# Altium schematic sheet SX1308_GTW_e381v02c_RF_Part.SchDoc: SX1280_Demo_RF
size A2; DrawnBy: Erik Fountain; DocumentNumber: 2; SheetNumber: 2; SheetTotal: 5; PageSetup: Record=PageOptions|CenterHorizontal=True|CenterVertical=True|PrintScale=0.47|XCorrection=1.00|YCorrection=1.00|PrintKind=0|BorderSize=5000000|LeftOffset=0|BottomOffset=0|Orientation=2|PaperLength=1000|PaperWidth=1000|Scale=100|PaperSource=7|PrintQuality=-4|MediaType=1|DitherType=10|PaperKind=Letter|PrintScaleMode=1; DocumentName: SX1280_Demo_RF
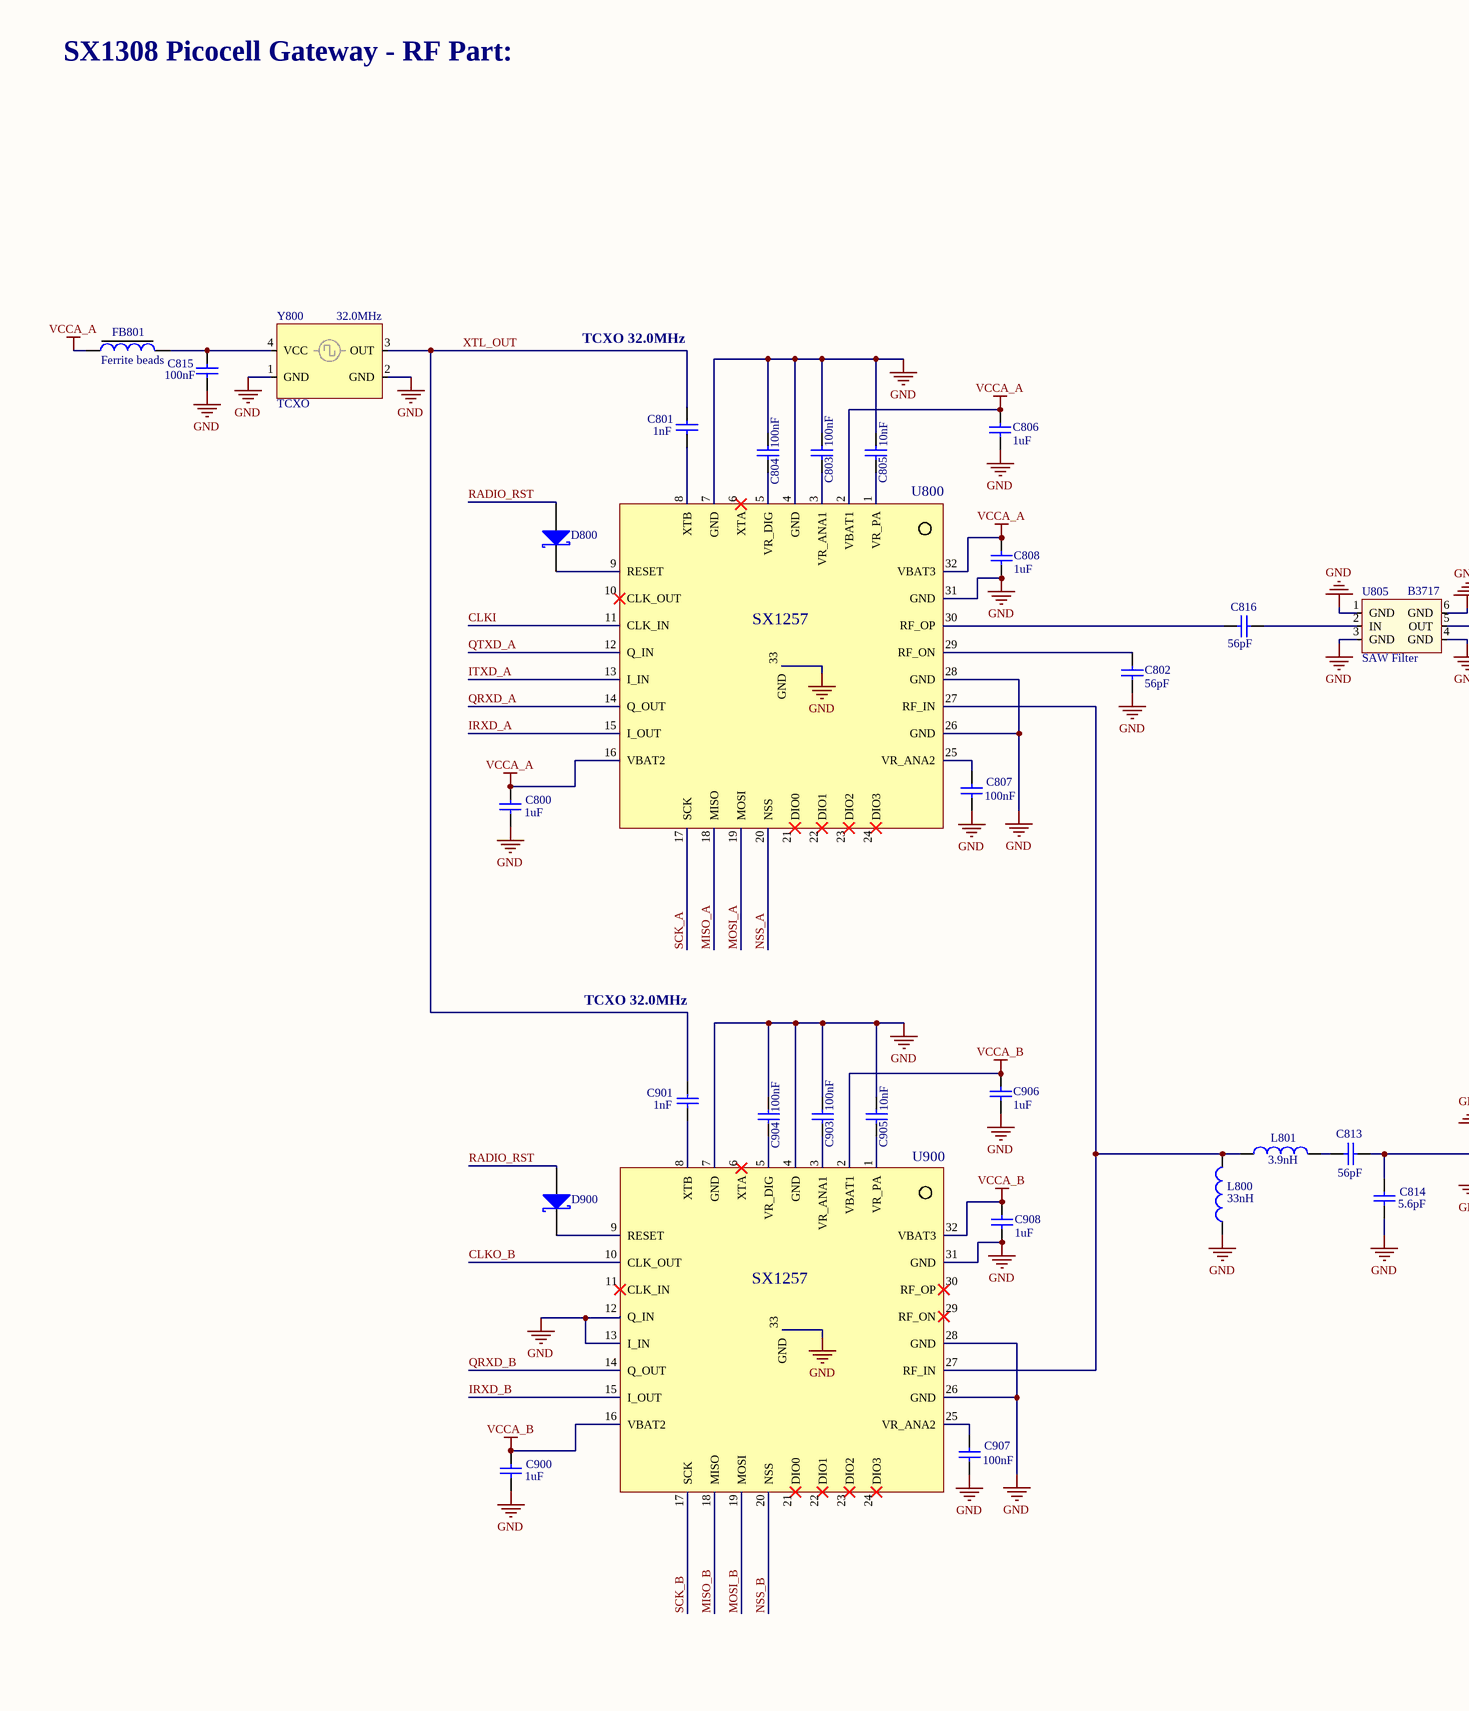
[diagram p0: SX1308_GTW_e381v02c_RF_Part.SchDoc, left]
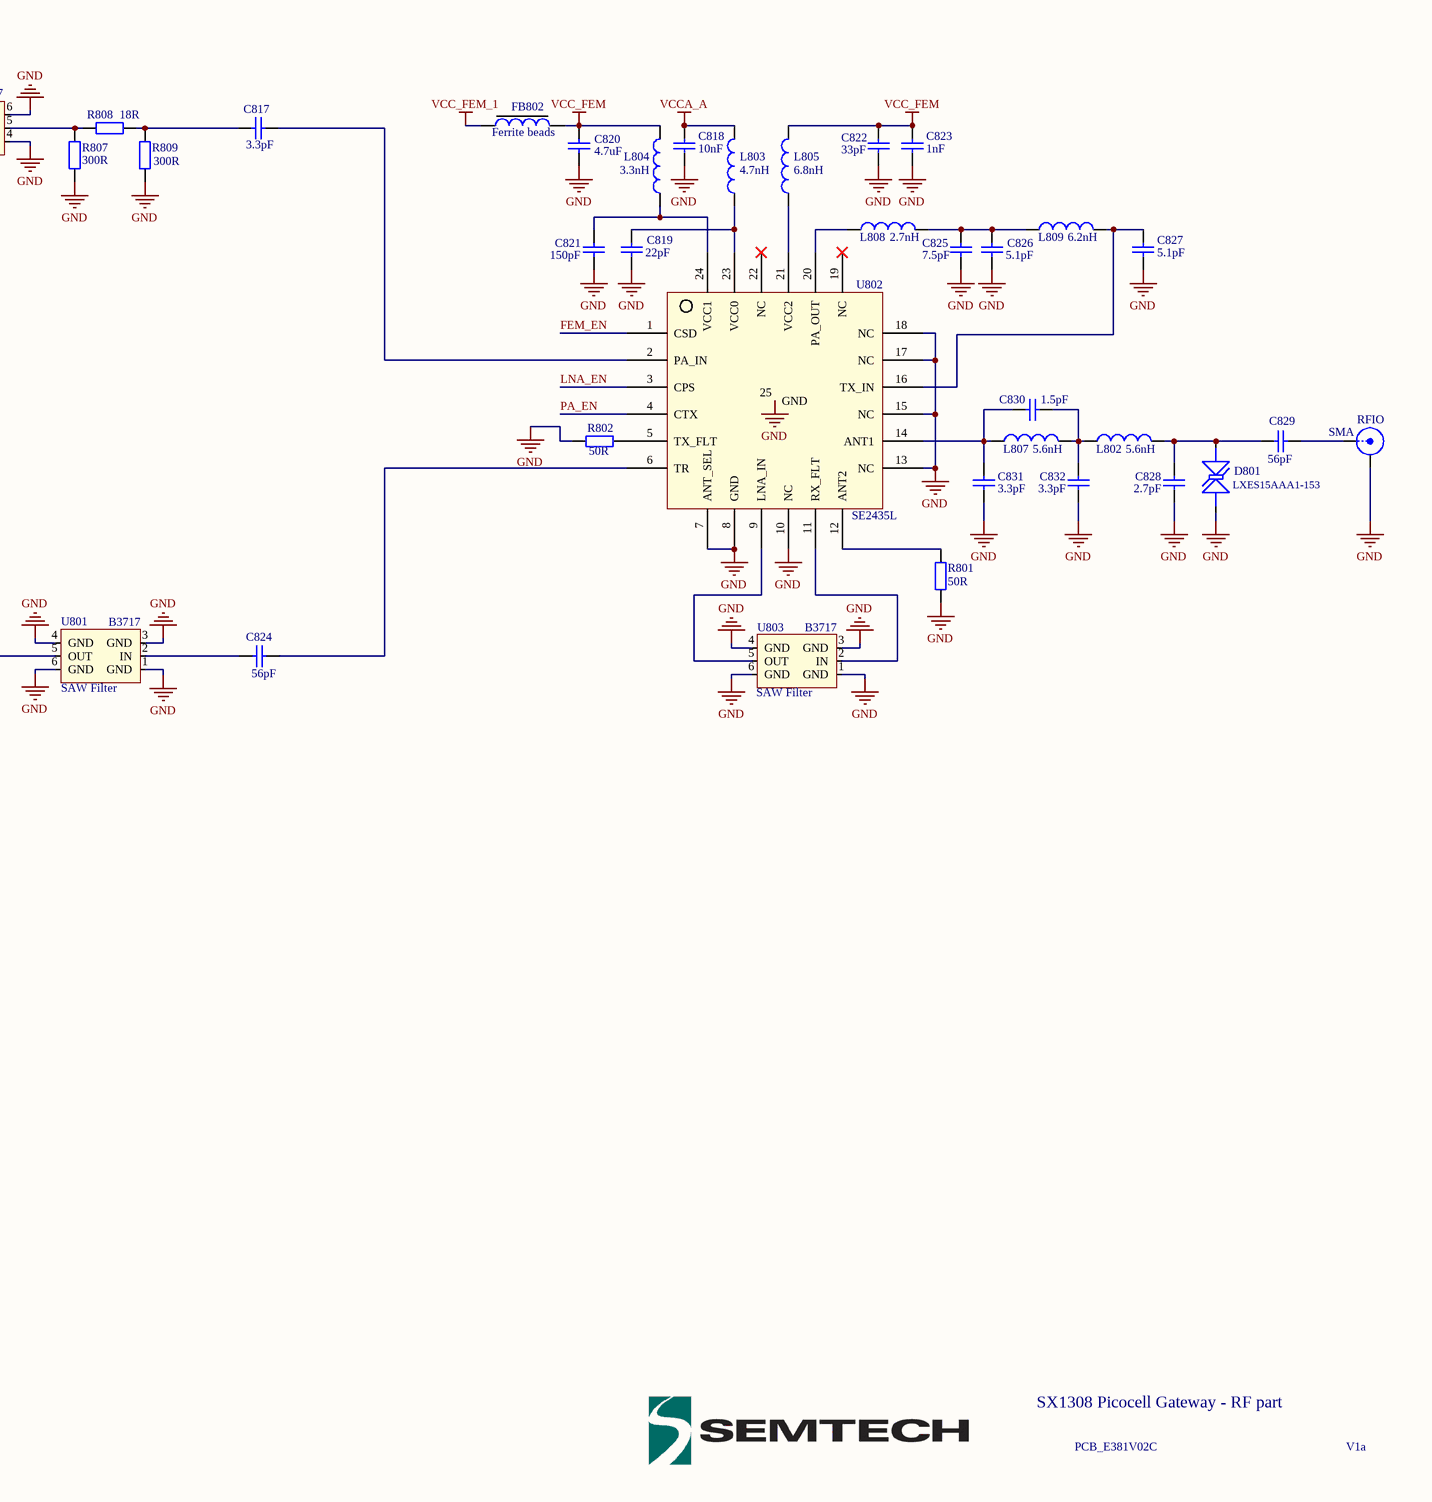
[diagram p1: SX1308_GTW_e381v02c_RF_Part.SchDoc, right]

## Parts
C800  value 1uF  [rlc_603_smd]  (hidden comment: Cap)
C801  value 1nF  [rlc_402_smd]  (hidden comment: Cap)
C802  value 56pF  [rlc_402_smd]  (hidden comment: Cap)
C803  value 100nF  [rlc_402_smd]  (hidden comment: Cap)
C804  value 100nF  [rlc_402_smd]  (hidden comment: Cap)
C805  value 10nF  [rlc_402_smd]  (hidden comment: Cap)
C806  value 1uF  [rlc_603_smd]  (hidden comment: Cap)
C807  value 100nF  [rlc_402_smd]  (hidden comment: Cap)
C808  value 1uF  [rlc_603_smd]  (hidden comment: Cap)
C813  value 56pF  [rlc_402_smd]  (hidden comment: Cap)
C814  value 5.6pF  [rlc_402_smd]  (hidden comment: Cap)
C815  value 100nF  [rlc_402_smd]  (hidden comment: Cap)
C816  value 56pF  [rlc_402_smd]  (hidden comment: Cap)
C817  value 3.3pF  [rlc_402_smd]  (hidden comment: Cap)
C818  value 10nF  [rlc_402_smd]  (hidden comment: Cap)
C819  value 22pF  [rlc_402_smd]  (hidden comment: Cap)
C820  value 4.7uF  [rlc_603_smd]  (hidden comment: Cap)
C821  value 150pF  [rlc_402_smd]  (hidden comment: Cap)
C822  value 33pF  [rlc_402_smd]  (hidden comment: Cap)
C823  value 1nF  [rlc_402_smd]  (hidden comment: Cap)
C824  value 56pF  [rlc_402_smd]  (hidden comment: Cap)
C825  value 7.5pF  [rlc_402_smd]  (hidden comment: Cap)
C826  value 5.1pF  [rlc_402_smd]  (hidden comment: Cap)
C827  value 5.1pF  [rlc_402_smd]  (hidden comment: Cap)
C828  value 2.7pF  [rlc_402_smd]  (hidden comment: Cap)
C829  value 56pF  [rlc_402_smd]  (hidden comment: Cap)
C830  value 1.5pF  [rlc_402_smd]  (hidden comment: Cap)
C831  value 3.3pF  [rlc_402_smd]  (hidden comment: Cap)
C832  value 3.3pF  [rlc_402_smd]  (hidden comment: Cap)
C900  value 1uF  [rlc_603_smd]  (hidden comment: Cap)
C901  value 1nF  [rlc_402_smd]  (hidden comment: Cap)
C903  value 100nF  [rlc_402_smd]  (hidden comment: Cap)
C904  value 100nF  [rlc_402_smd]  (hidden comment: Cap)
C905  value 10nF  [rlc_402_smd]  (hidden comment: Cap)
C906  value 1uF  [rlc_603_smd]  (hidden comment: Cap)
C907  value 100nF  [rlc_402_smd]  (hidden comment: Cap)
C908  value 1uF  [rlc_603_smd]  (hidden comment: Cap)
D800  D Schottky  [SOD523]  (value not drawn)
D801  Type: LXES15AAA1-153  [SLP1006P2T]  (hidden comment: RClamp0531T)
D900  D Schottky  [SOD523]  (value not drawn)
FB801  Ferrite beads  [rlc_402_smd]
FB802  Ferrite beads  [rlc_603_smd]
L800  value 33nH  [rlc_402_smd]  (hidden comment: Inductor)
L801  value 3.9nH  [rlc_402_smd]  (hidden comment: Inductor)
L802  value 5.6nH  [rlc_402_smd]  (hidden comment: Inductor)
L803  value 4.7nH  [rlc_402_smd]  (hidden comment: Inductor)
L804  value 3.3nH  [rlc_402_smd]  (hidden comment: Inductor)
L805  value 6.8nH  [rlc_402_smd]  (hidden comment: Inductor)
L807  value 5.6nH  [rlc_402_smd]  (hidden comment: Inductor)
L808  value 2.7nH  [rlc_402_smd]  (hidden comment: Inductor)
L809  value 6.2nH  [rlc_402_smd]  (hidden comment: Inductor)
R801  value 50R  [rlc_402_smd]  (hidden comment: Resistor)
R802  value 50R  [rlc_402_smd]  (hidden comment: Resistor)
R807  value 300R  [rlc_402_smd]  (hidden comment: Resistor)
R808  value 18R  [rlc_402_smd]  (hidden comment: Resistor)
R809  value 300R  [rlc_402_smd]  (hidden comment: Resistor)
RFIO  SMA  [SMA_end_launch_1.6mm_6.35mm]
U800  SX1257  [vqfn32_5x5mm]
U801  SAW Filter  value B3717  [DCC6C_3.0x3.0mm]
U802  SE2435L  [vqfn24_4x4mm RF]
U803  SAW Filter  value B3717  [DCC6C_3.0x3.0mm]
U805  SAW Filter  value B3717  [DCC6C_3.0x3.0mm]
U900  SX1257  [vqfn32_5x5mm]
Y800  TCXO  value 32.0MHz  [TCXO 2.0x1.6mm]

## Nets
GND: C800.1 C802.2 C803.1 C804.2 C805.2 C806.1 C807.1 C808.1 C814.2 C815.1 C818.1 C819.1 C820.1 C821.1 C822.1 C823.1 C825.1 C826.1 C827.1 C828.2 C831.1 C832.2 C900.1 C903.1 C904.2 C905.2 C906.1 C907.1 C908.1 D801.2(K) L800.1 R801.2 R802.2 R807.1 R809.1 RFIO.2(GND) U800.4(GND) U800.7(GND) U800.26(GND) U800.28(GND) U800.31(GND) U800.33(GND) U801.1(GND) U801.3(GND) U801.4(GND) U801.6(GND) U802.7(ANT_SEL) U802.8(GND) U802.10(NC) U802.13(NC) U802.15(NC) U802.17(NC) U802.18(NC) U802.25(GND) U803.1(GND) U803.3(GND) U803.4(GND) U803.6(GND) U805.1(GND) U805.3(GND) U805.4(GND) U805.6(GND) U900.4(GND) U900.7(GND) U900.12(Q_IN) U900.13(I_IN) U900.26(GND) U900.28(GND) U900.31(GND) U900.33(GND) Y800.1(GND) Y800.2(GND)
VCC_FEM: C820.2 C822.2 C823.2 FB802.2 L804.2 L805.2
VCC_FEM_1: FB802.1
VCCA_A: C800.2 C806.2 C808.2 C818.2 FB801.1 L803.2 U800.2(VBAT1) U800.16(VBAT2) U800.32(VBAT3)
VCCA_B: C900.2 C906.2 C908.2 U900.2(VBAT1) U900.16(VBAT2) U900.32(VBAT3)
CLKI: U800.11(CLK_IN)
CLKO_B: U900.10(CLK_OUT)
FEM_EN: U802.1(CSD)
IRXD_A: U800.15(I_OUT)
IRXD_B: U900.15(I_OUT)
ITXD_A: U800.13(I_IN)
LNA_EN: U802.3(CPS)
MISO_A: U800.18(MISO)
MISO_B: U900.18(MISO)
MOSI_A: U800.19(MOSI)
MOSI_B: U900.19(MOSI)
NSS_A: U800.20(NSS)
NSS_B: U900.20(NSS)
PA_EN: U802.4(CTX)
QRXD_A: U800.14(Q_OUT)
QRXD_B: U900.14(Q_OUT)
QTXD_A: U800.12(Q_IN)
RADIO_RST: D800.2(A) D900.2(A)
SCK_A: U800.17(SCK)
SCK_B: U900.17(SCK)
XTL_OUT: C801.1 C901.2 Y800.3(OUT)
NetC801_2: C801.2 U800.8(XTB)
NetC802_1: C802.1 U800.29(RF_ON)
NetC803_2: C803.2 U800.3(VR_ANA1)
NetC804_1: C804.1 U800.5(VR_DIG)
NetC805_1: C805.1 U800.1(VR_PA)
NetC807_2: C807.2 U800.25(VR_ANA2)
NetC813_1: C813.1 L801.2
NetC813_2: C813.2 C814.1 U801.5(OUT)
NetC815_2: C815.2 FB801.2 Y800.4(VCC)
NetC816_1: C816.1 U800.30(RF_OP)
NetC816_2: C816.2 U805.2(IN)
NetC817_1: C817.1 R808.2 R809.2
NetC817_2: C817.2 U802.2(PA_IN)
NetC819_2: C819.2 L803.1 U802.23(VCC0)
NetC821_2: C821.2 L804.1 U802.24(VCC1)
NetC824_1: C824.1 U801.2(IN)
NetC824_2: C824.2 U802.6(TR)
NetC825_2: C825.2 C826.2 L808.2 L809.1
NetC827_2: C827.2 L809.2 U802.16(TX_IN)
NetC828_1: C828.1 C829.1 D801.1(A) L802.2
NetC829_2: C829.2 RFIO.1(Signal)
NetC830_1: C830.1 C832.1 L802.1 L807.2
NetC830_2: C830.2 C831.2 L807.1 U802.14(ANT1)
NetC901_1: C901.1 U900.8(XTB)
NetC903_2: C903.2 U900.3(VR_ANA1)
NetC904_1: C904.1 U900.5(VR_DIG)
NetC905_1: C905.1 U900.1(VR_PA)
NetC907_2: C907.2 U900.25(VR_ANA2)
NetD800_1: D800.1(K) U800.9(RESET)
NetD900_1: D900.1(K) U900.9(RESET)
NetL800_2: L800.2 L801.1 U800.27(RF_IN) U900.27(RF_IN)
NetL805_1: L805.1 U802.21(VCC2)
NetL808_1: L808.1 U802.20(PA_OUT)
NetR801_1: R801.1 U802.12(ANT2)
NetR802_1: R802.1 U802.5(TX_FLT)
NetR807_2: R807.2 R808.1 U805.5(OUT)
NetU802_9: U802.9(LNA_IN) U803.5(OUT)
NetU802_11: U802.11(RX_FLT) U803.2(IN)

Not connected (* = marked no-connect by the designer): U800 6(XTA)* 10(CLK_OUT)* 21(DIO0)* 22(DIO1)* 23(DIO2)* 24(DIO3)*; U802 19(NC)* 22(NC)*; U900 6(XTA)* 11(CLK_IN)* 21(DIO0)* 22(DIO1)* 23(DIO2)* 24(DIO3)* 29(RF_ON)* 30(RF_OP)*

## Notes on the sheet
- SX1308 Picocell Gateway - RF Part:
- TCXO 32.0MHz
- SX1308 Picocell Gateway - RF part
- PCB_E381V02C
- V1a

## Library data of the parts
C800-C808 C813-C832 C900 C901 C903-C908 = Cap: Capacitor SMD; Published: 8-Jun-2000; LatestRevisionDate: 05-oct-2007  -  Semtech; LatestRevisionNote: Re-released for DXP Platform.; Publisher: Altium Limited
D800 D900 = D Schottky: Schottky Diode; Published: 8-Jun-2000; LatestRevisionDate: 17-Jul-2002; LatestRevisionNote: Re-released for DXP Platform.; PackageReference: SMB; Publisher: Altium Limited
D801 = RClamp0531T: Ultra Low Capacitance 1-line ESD Protection; LatestRevisionDate: 23-Aug-2016
FB801 FB802 = Ferrite beads: Value: VAL?
L800-L805 L807-L809 = Inductor: Code_IEC: 1005; Published: 8-Jun-2000; LatestRevisionDate: 05-oct-2007  -  Semtech; LatestRevisionNote: Re-released for DXP Platform.; Publisher: Altium Limited; Code_JEITA: 0402
R801 R802 R807-R809 = Resistor: Resistor SMD - IEC symbol version; LatestRevisionDate: 27-Jul-20  -  Semtech
RFIO = SMA: SMA Straight Connector; LatestRevisionDate: 05-oct-2007  -  Semtech; LatestRevisionNote: Re-released for DXP Platform.; Publisher: Altium Limited
U800 U900 = SX1257: SX1257 RF Front-End Transceiver - I/Q New Pinout; LatestRevisionDate: 06-Dec-2013  -  Semtech
U801 U803 U805 = SAW Filter: SAW Filter - Bandpass - TEMEX type; LatestRevisionDate: 05-oct-2007  -  Semtech
U802 = SE2435L: SE2435L - Skyworks High Power RF Front End Module